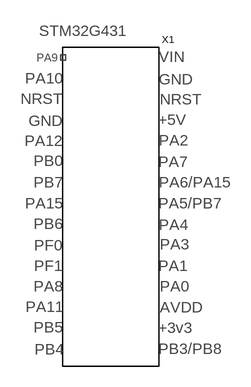
[diagram p0: schematic Schécm_complet_circuit.asc]
Schécm_complet_circuit.asc, the LTspice schematic file:
Version 4.1
SHEET 1 880 680
SYMBOL STM32G431 112 32 R0
SYMATTR InstName X1

The netlist it stands for:
* Schécm_complet_circuit.asc
X§X1 NC_01 STM32G431  ; pins PA9
.backanno
.end